# Altium schematic sheet power-supply.SchDoc
size B
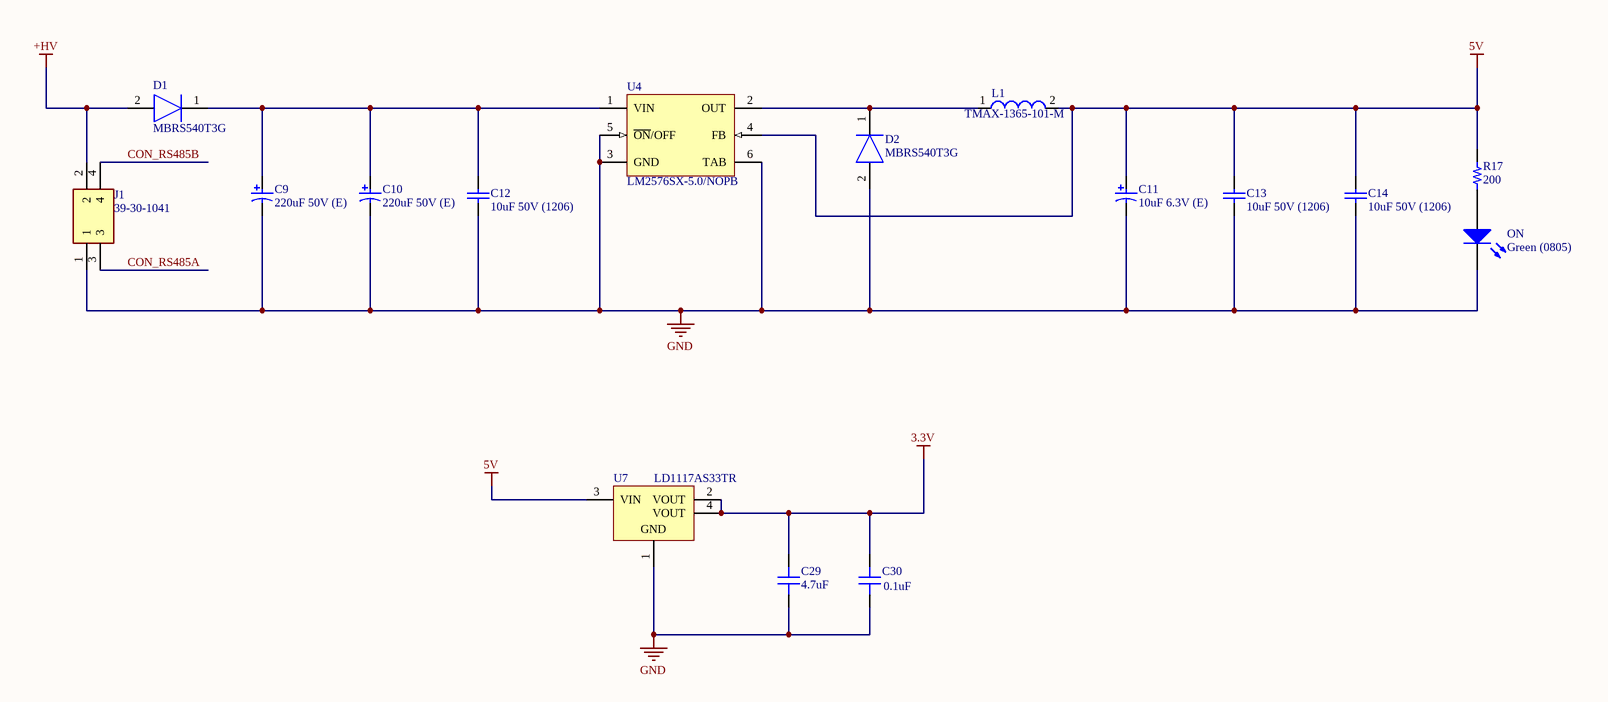
[diagram p0: power-supply.SchDoc]

## Parts
C9  220uF 50V (E)  [PNSC-EEE-1HA221P_L]
C10  220uF 50V (E)  [PNSC-EEE-1HA221P_L]
C11  10uF 6.3V (E)  [NIC-CAPA2-8X10_V]
C12  10uF 50V (1206)  [CAPC3216X229X50LL20T25]
C13  10uF 50V (1206)  [CAPC3216X229X50LL20T25]
C14  10uF 50V (1206)  [CAPC3216X229X50LL20T25]
C29  4.7uF  [CAP 1206_3216 - 1.8MM]
C30  0.1uF  [CAP 0603_1608]
D1  MBRS540T3G  [DIOM7958X256N]
D2  MBRS540T3G  [DIOM7958X256N]
J1  39-30-1041  [39-30-1040]
L1  TMAX-1365-101-M  [WE-HCI-1365]
ON  Green (0805)  [0805_A]
R17  200  [RES 0603_1608]
U4  LM2576SX-5.0/NOPB  [KTT0005B_M]
U7  LD1117AS33TR  [SOT-223_M]

## Nets
3.3V: C29.2 C30.2 U7.2(VOUT) U7.4(VOUT)
5V: C11.1 C13.2 C14.2 L1.2 R17.2 U4.4(FB) U7.3(VIN)
+HV: D1.2(A) J1.2
GND: C9.2 C10.2 C11.2 C12.1 C13.1 C14.1 C29.1 C30.1 D2.2(A) J1.1 ON.1(K) U4.3(GND) U4.5(~{ON}/OFF) U4.6(TAB) U7.1(GND)
CON_RS485A: J1.3
CON_RS485B: J1.4
NetC9_1: C9.1 C10.1 C12.2 D1.1(K) U4.1(VIN)
NetD2_1: D2.1(K) L1.1 U4.2(OUT)
NetON_2: ON.2(A) R17.1

## Notes on the sheet
- Title
- Size:
- Date:
- B
- Number:
- Time:
- Revision:
- Sheet
- of
- Maptix Co.,Ltd
- 99/193 Atoll Bali Beach
- Khlong Luang Phaeng
- Chacheongsao
- Thailand 24000
- File:

## Library data of the parts
C9 C10 = CMP-2000-06200-1: Aluminum Electrolytic Capacitor, 220 uF, +/- 20%, 50 V, -40 to 85 degC, 2-Pin SMD, RoHS, Tape and Reel; Manufacturer: Panasonic; Lifetime @ Temperature: 2000hours@85°C; AE Capacitor Case: RadialCan-SMD; Capacitance: 220µF; Ripple Current AC: 300mA; SVHC: ToBeAdvised; Product Range: PANASONIC-SSeries; Datasheet Version: 11/2012; Manufacturer URL: http://www.panasonic.com/; Packaging: CutTape; Life Time @ Temperature: 2000hours@85°C; Capacitor Case Style: RadialCan-SMD; Capacitance Tolerance ±: ±20%; Mounting Technology: SurfaceMount; Operating Temperature Max: 85°C; Capacitance Tolerance: ±20%; Package Description: 2-Pin Surface Mount Device, Body 10.3 x 10.3 mm; Voltage Rating: 50V; Package Reference: SMD; Diameter: 10mm; Height: 10.2mm; Operating Temperature Min: -40°C; Datasheet URL: http://datasheet.octopart.com/EEE-1HA221P-Panasonic-datasheet-13265900.pdf
C11 = CMP-0687-00071-1: Aluminum Electrolytic Capacitor, UD Series, Low Impedance, 1000 uF, 6.3 V, + / - 20%, -55 to 105 degC, Chip Type, 8 x 10 mm D x L, Pb-Free, Reel; Manufacturer: Nichicon; PartNumber: UUD0J102MNL1GS; Impedance: 0.17 Ohm; Endurance Time: 5000 h; Rated Capacitance: 1000 uF; Rated Ripple Current (at 100kHz): 450 mA; Packing: Dia382mm Reel; Tolerance Rated Capacitance: -20 to 20%; Diameter: 8 mm; ComponentLink3Description: Package Specification; Mounting Technology: Surface Mount; RoHS: TRUE; ComponentLink3URL: http://products.nichicon.co.jp/en/pdf/XJA043/e-ud.pdf; Length: 10 mm; PackageDescription: 2-Pin Surface Mount Device, Diameter 8 mm, Height 10 mm, Pitch 6.5 mm; DatasheetVersion: 08/2012; ComponentLink2Description: Datasheet; ComponentLink1URL: http://www.nichicon.co.jp/; ComponentLink1Description: Manufacturer URL; Rated Voltage: 6.3 V; ComponentLink2URL: http://products.nichicon.co.jp/en/pdf/XJA043/e-ud.pdf; PackageReference: CAPAE-D8H10
C12-C14 = CMP-2000-05863-1: Chip Capacitor, 10 uF, +/- 10%, 25 V, -55 to 85 degC, 1206 (3216 Metric), RoHS, Tape and Reel; Manufacturer: AVX; Rated Voltage: 25V; Dielectric: X5R; Capacitance: 10µF; Mounting Technology: SurfaceMount; Package Reference: 1206; Tolerance (%): ±10%; Manufacturer URL: http://www.avx.com/; Datasheet URL: http://datasheets.avx.com/cx5r.pdf; Package Description: 2-Pin Surface Mount Device, Body 3.2 x 1.6 mm; Datasheet Version: 05/2016; Case Size/Dimension: 1206
C29 = C1206C335K4PACTU: CAP CERAMIC 16V X5R 1206; Manufacturer: KEMET; Capacitance: 3.3µF; Tolerance: ±10%; Part Number: C1206C335K4PACTU; Value: 4.7uF; Applications: General Purpose; ComponentLink1Description: Datasheet; ComponentLink1URL: https://api.kemet.com/component-edge/download/datasheet/C1206C335K4PACTU.pdf; ComponentLink2Description: DigiKey Link; ComponentLink2URL: http://digikey.com/product-detail/en/kemet/C1206C335K4PACTU/399-1264-1-ND/411539; Device Package: 1206 (3216 Metric); LastUpdated: 1/2/2020 12:03:41 AM; Lifecycle Status: Active; Minimum Order: 1; Mounting Type: Surface Mount, MLCC; Operating Temperature: -55°C ~ 85°C; Package / Case: 1206 (3216 Metric); Packaging: ReReel; PartId: 19546; Part Status: Active; Price: 0.00; Series: SMD Comm X5R; Size / Dimension: 0.126" L x 0.063" W (3.20mm x 1.60mm); Supplier 1: DigiKey; Supplier Part Number 1: 399-1264-1-ND; Temperature Coefficient: X5R; Thickness (Max): 0.071" (1.80mm); Voltage - Rated: 16V
C30 = VJ0603Y332JXACW1BC: CAP CERAMIC 50V X7R 0603; Manufacturer: Vishay Vitramon; Capacitance: 3300pF; Tolerance: ±5%; Part Number: VJ0603Y332JXACW1BC; Value: 0.1uF; Applications: General Purpose; ComponentLink1Description: Datasheet; ComponentLink1URL: https://www.vishay.com/docs/28548/vjw1bcbascomseries.pdf; ComponentLink2Description: DigiKey Link; ComponentLink2URL: http://digikey.com/product-detail/en/vishay-vitramon/VJ0603Y332JXACW1BC/720-VJ0603Y332JXACW1BCCT-ND/11198425; Device Package: 0603 (1608 Metric); LastUpdated: 1/2/2020 12:01:35 AM; Lifecycle Status: Active; Minimum Order: 1; Mounting Type: Surface Mount, MLCC; Operating Temperature: -55°C ~ 125°C; Package / Case: 0603 (1608 Metric); Packaging: Unknown; PartId: 26247; Part Status: Active; Price: 0.00; Series: VJ; Size / Dimension: 0.063" L x 0.031" W (1.60mm x 0.80mm); Supplier 1: DigiKey; Supplier Part Number 1: 720-VJ0603Y332JXACW1BCCT-ND; Temperature Coefficient: X7R; Thickness (Max): 0.034" (0.87mm); Voltage - Rated: 50V
D1 D2 = MBRS540T3G: Diode; Manufacturer_Name: ON Semiconductor; Allied_Number: 70100196; Datasheet Link: http://www.onsemi.com/pub/Collateral/MBRS540T3-D.PDF; Height: 2.56mm; Manufacturer_Part_Number: MBRS540T3G; Mouser Part Number: 863-MBRS540T3G; Mouser Price/Stock: https://www.mouser.com/Search/Refine.aspx?Keyword=863-MBRS540T3G; RS Part Number: 6880512; RS Price/Stock: https://uk.rs-online.com/web/p/products/6880512; Allied Price/Stock: http://www.alliedelec.com/on-semiconductor-mbrs540t3g/70100196/
J1 = 39-30-1041: Connector; Manufacturer_Name: Molex; Allied_Number: 70374118; Datasheet Link: http://docs-emea.rs-online.com/webdocs/150e/0900766b8150e03e.pdf; Manufacturer_Part_Number: 39-30-1041; Mouser Part Number: 538-39-30-1041; Mouser Price/Stock: https://www.mouser.com/Search/Refine.aspx?Keyword=538-39-30-1041; RS Part Number: 6705754; RS Price/Stock: https://uk.rs-online.com/web/p/products/6705754; Allied Price/Stock: https://www.alliedelec.com/molex-incorporated-39-30-1041/70374118/
L1 = CMP-1351-00012-1: SMD Flat Wire High Current Inductor WE-HCI, L=33.0 µH; Manufacturer: Wuerth Elektronik; PartNumber: 7443551331; Inductance: 33.0 ÂµH; ComponentLink1Description: Manufacturer URL; ComponentLink1URL: http://www.we-online.com; PackageDescription: Inductor, 2-Leads, Body 13.2 x 12.8 mm; ComponentLink2URL: http://katalog.we-online.de/kataloge/eisos/media/pdf/7443551331.pdf; ComponentLink2Description: Datasheet; PackageReference: WE-HCI-1365
ON = CMP-1426-00007-1: SMD mono-color Chip LED, WL-SMCW, Green; PartNumber: 150080GS75000; Manufacturer: Wuerth Elektronik; PackageReference: 0805_A; Color: Green; ComponentLink2URL: http://katalog.we-online.com/led/datasheet/150080GS75000.pdf; ComponentLink1URL: http://www.we-online.com; ComponentLink1Description: Manufacturer URL; ComponentLink2Description: Datasheet
R17 = CRCW060329K4FKEA: Resistor; Manufacturer: Vishay Dale; Power (Watts): 0.1W, 1/10W; Resistance: 29.4 kOhms; Temperature Coefficient: ±100ppm/°C; Tolerance: ±1%; Part Number: CRCW060329K4FKEA; Value: 200; ComponentLink1Description: Datasheet; ComponentLink1URL: http://www.vishay.com/docs/20035/dcrcwe3.pdf; ComponentLink2Description: DigiKey Link; ComponentLink2URL: http://digikey.com/product-detail/en/vishay-dale/CRCW060329K4FKEA/541-29.4KHCT-ND/1179975; Composition: Thick Film; Device Package: 0603 (1608 Metric); Features: Automotive AEC-Q200; Height - Seated (Max): 0.020" (0.50mm); LastUpdated: 1/2/2020 12:06:58 AM; Lifecycle Status: Active; Minimum Order: 1; Number of Terminations: 2; Operating Temperature: -55°C ~ 155°C; Package / Case: 0603 (1608 Metric); Packaging: TapeAndReel; PartId: 7975; Part Status: Active; Price: 0.00; Ratings: AEC-Q200; Series: CRCW; Size / Dimension: 0.061" L x 0.033" W (1.55mm x 0.85mm); Supplier 1: DigiKey; Supplier Part Number 1: 541-29.4KHCT-ND; Supplier Device Package: 0603
U4 = CMP-0069-00122-3: SIMPLE SWITCHER® 3A Step-Down Voltage Regulator, 5-pin TO-263, Pb-Free; Manufacturer: Texas Instruments; PackageTopMarking: NSUZXYTTE#*LM2576S*-5.0 P+; PowerWise: N; PackageDescription: TO-263, Molded, .400 x .390 x .180in, 5 Lead, .067in Pitch, Surface Mount; PinCount: 5; PackageReference: KTT0005B; ComponentLink1Description: Datasheet URL; ComponentLink1URL: http://www.ti.com/general/docs/lit/getliterature.tsp?genericPartNumber=LM2576&fileType=pdf; Code_JEDEC: MO-169-AB; CompType: Switcher; RoHS: Y
U7 = CMP-0244-00316-1: 1A, Low Drop Positive Voltage Regulator, 3.3V, 4-Pin SOT-223, Tape and Reel; ComponentLink1Description: Manufacturer URL; DatasheetVersion: 2/12/2011; PackageVersion: 2010; ComponentLink1URL: http://www.st.com; ComponentLink2Description: Datasheet; ComponentLink2URL: http://www.st.com/internet/com/TECHNICAL_RESOURCES/TECHNICAL_LITERATURE/DATASHEET/CD00002116.pdf; PackageDescription: 4-Pin SOT-223 Package, 6.5 x 3.5 mm Body, 2.3 mm Pitch, 7 mm Lead Span; PackageReference: SOT-223